# EAGLE design v1.2 (EAGLE 9.4.2)
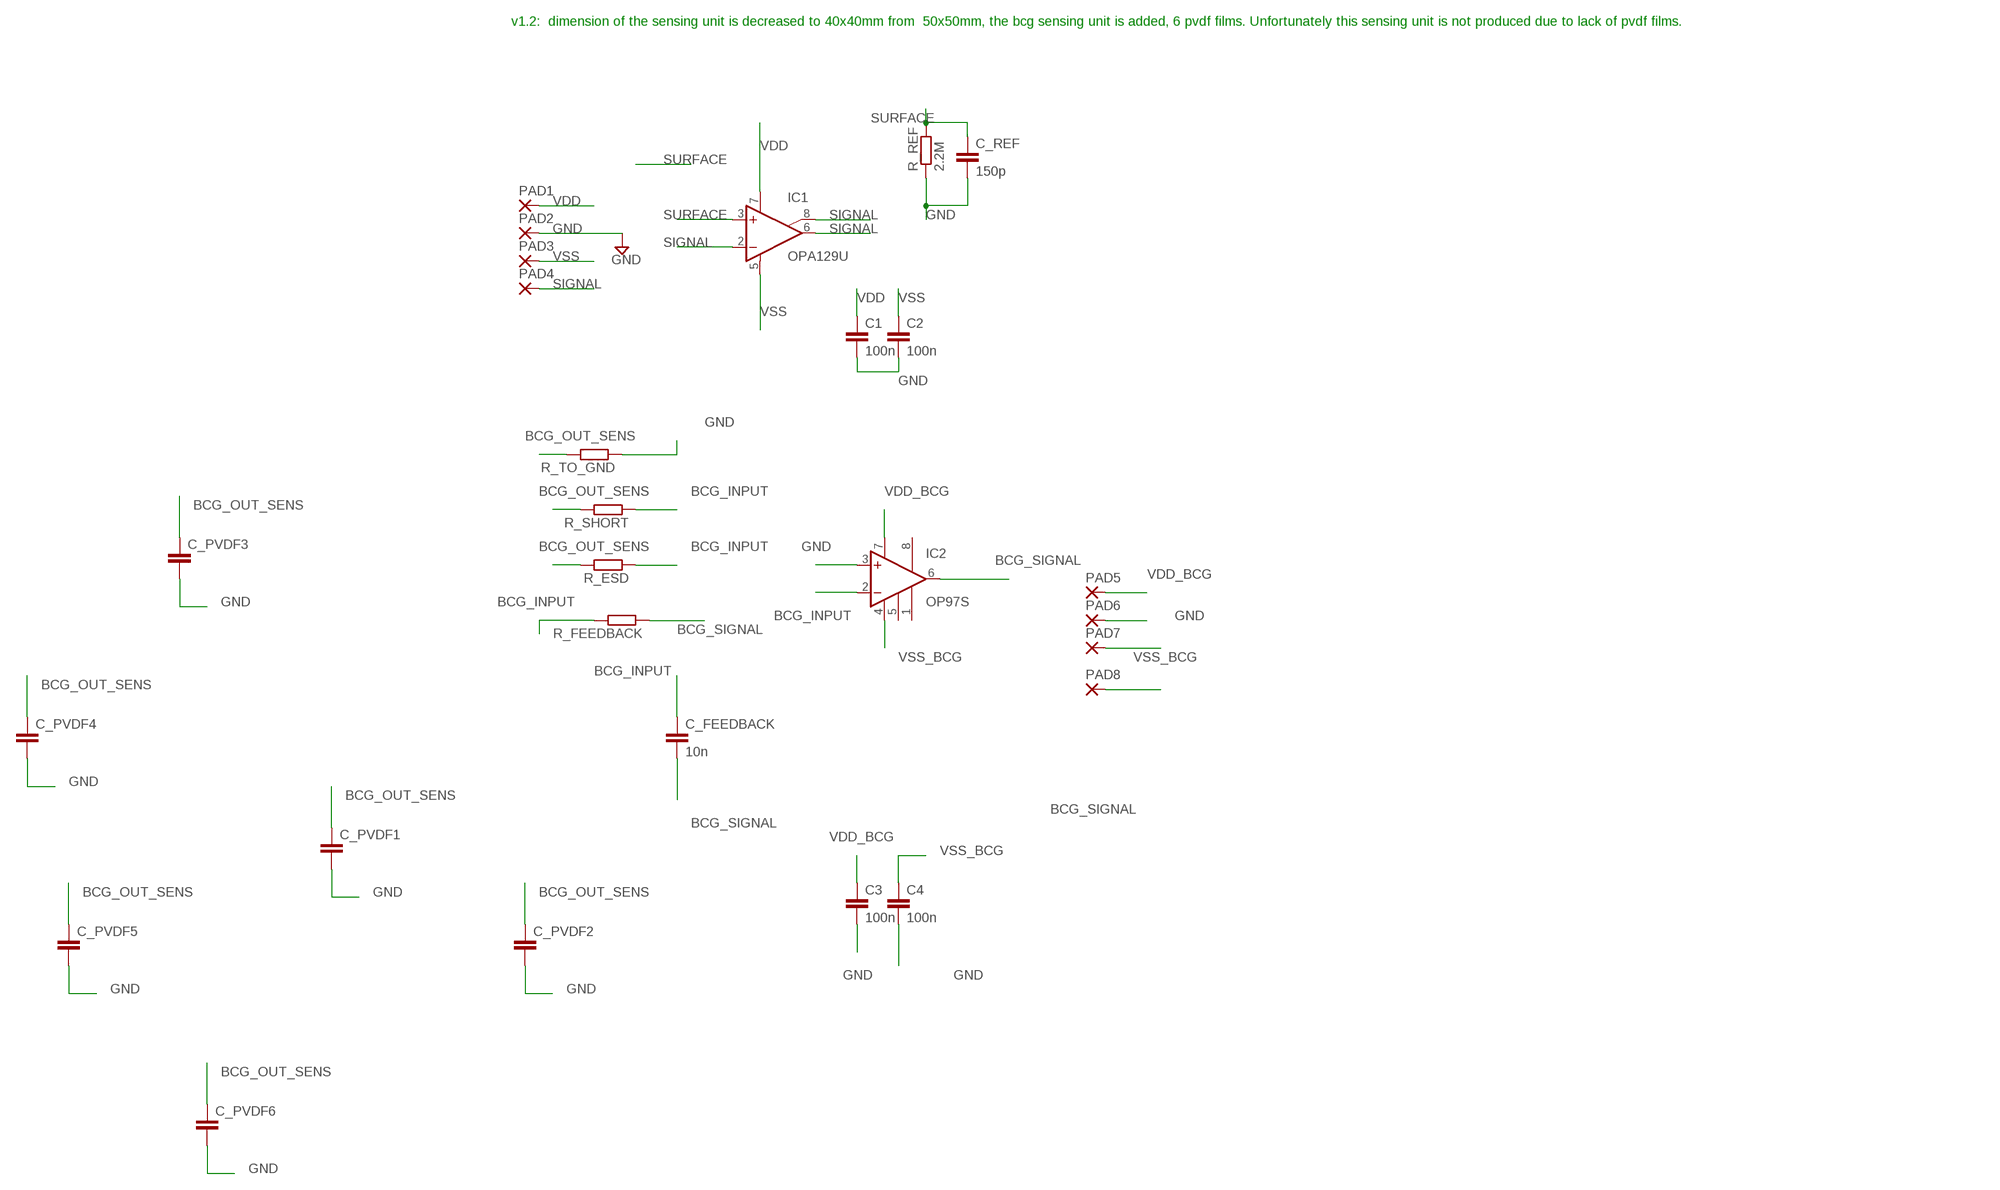
[diagram p0: schematic, sheet 1]

## Parts
C1  100n  C-EUC0805  [C0805]
C2  100n  C-EUC0805  [C0805]
C3  100n  C-EUC0805  [C0805]
C4  100n  C-EUC0805  [C0805]
C_FEEDBACK  10n  C-EUC0805  [C0805]
C_PVDF1  C-EUC0805  [C0805]
C_PVDF2  C-EUC0805  [C0805]
C_PVDF3  C-EUC0805  [C0805]
C_PVDF4  C-EUC0805  [C0805]
C_PVDF5  C-EUC0805  [C0805]
C_PVDF6  C-EUC0805  [C0805]
C_REF  150p  C-EUC0805  [C0805]
IC1  OPA129U  [SO08]
IC2  OP97S  [SO08]
PAD1  SMD5  [SMD2,54-5,08]
PAD2  SMD5  [SMD2,54-5,08]
PAD3  SMD5  [SMD2,54-5,08]
PAD4  SMD5  [SMD2,54-5,08]
PAD5  SMD5  [SMD2,54-5,08]
PAD6  SMD5  [SMD2,54-5,08]
PAD7  SMD5  [SMD2,54-5,08]
PAD8  SMD5  [SMD2,54-5,08]
R_ESD  1M  R-EU_M0805  [M0805]
R_FEEDBACK  100M  R-EU_M0805  [M0805]
R_REF  2.2M  R-EU_M0805  [M0805]
R_SHORT  1M  R-EU_M0805  [M0805]
R_TO_GND  1M  R-EU_M0805  [M0805]

## Nets
BCG_INPUT: C_FEEDBACK.1 IC2.2(-IN) R_ESD.1 R_FEEDBACK.2 R_SHORT.1
BCG_OUT_SENS: C_PVDF1.1 C_PVDF2.1 C_PVDF3.1 C_PVDF4.1 C_PVDF5.1 C_PVDF6.1 R_ESD.2 R_SHORT.2 R_TO_GND.2
BCG_SIGNAL: C_FEEDBACK.2 IC2.6(OUT) PAD8.1(P) R_FEEDBACK.1
GND: C1.2 C2.2 C3.2 C4.2 C_PVDF1.2 C_PVDF2.2 C_PVDF3.2 C_PVDF4.2 C_PVDF5.2 C_PVDF6.2 C_REF.2 IC2.3(+IN) PAD2.1(P) PAD6.1(P) R_REF.1 R_TO_GND.1
SIGNAL: IC1.2(-IN) IC1.6(OUT) IC1.8(SUBS) PAD4.1(P)
SURFACE: C_REF.1 IC1.3(+IN) R_REF.2
VDD: C1.1 IC1.7(V+) PAD1.1(P)
VDD_BCG: C3.1 IC2.7(V+) PAD5.1(P)
VSS: C2.1 IC1.5(V-) PAD3.1(P)
VSS_BCG: C4.1 IC2.4(V-) PAD7.1(P)
Unconnected: IC2.1(BAL1) IC2.5(COMP) IC2.8(BAL2)

## Notes on the sheet
- v1.2:  dimension of the sensing unit is decreased to 40x40mm from  50x50mm, the bcg sensing unit is added, 6 pvdf films. Unfortunately this sensing unit is not produced due to lack of pvdf films.

## Library data of the parts
C1-C4 C_REF = resistor:C-EU: CAPACITOR, European symbol
C_FEEDBACK C_PVDF1-C_PVDF6 = rcl:C-EU: CAPACITOR, European symbol; SPICEPREFIX: C
IC1 = burr-brown:OPA129: Difet Operational Amplifier Ultra-Low Bias Current; MF: TEXAS INSTRUMENTS; MPN: OPA129U; OC_FARNELL: 1206925; OC_NEWARK: 80K6004
IC2 = linear:OP97: Low Power, High Precision Operational Amplifier Source: http://www.analog.com/static/imported-files/data_sheets/OP97.pdf
PAD1-PAD8 = wirepad:SMD5: SMD PAD
R_ESD R_FEEDBACK R_REF R_SHORT R_TO_GND = rcl:R-EU_: RESISTOR, European symbol; SPICEPREFIX: R

## Board
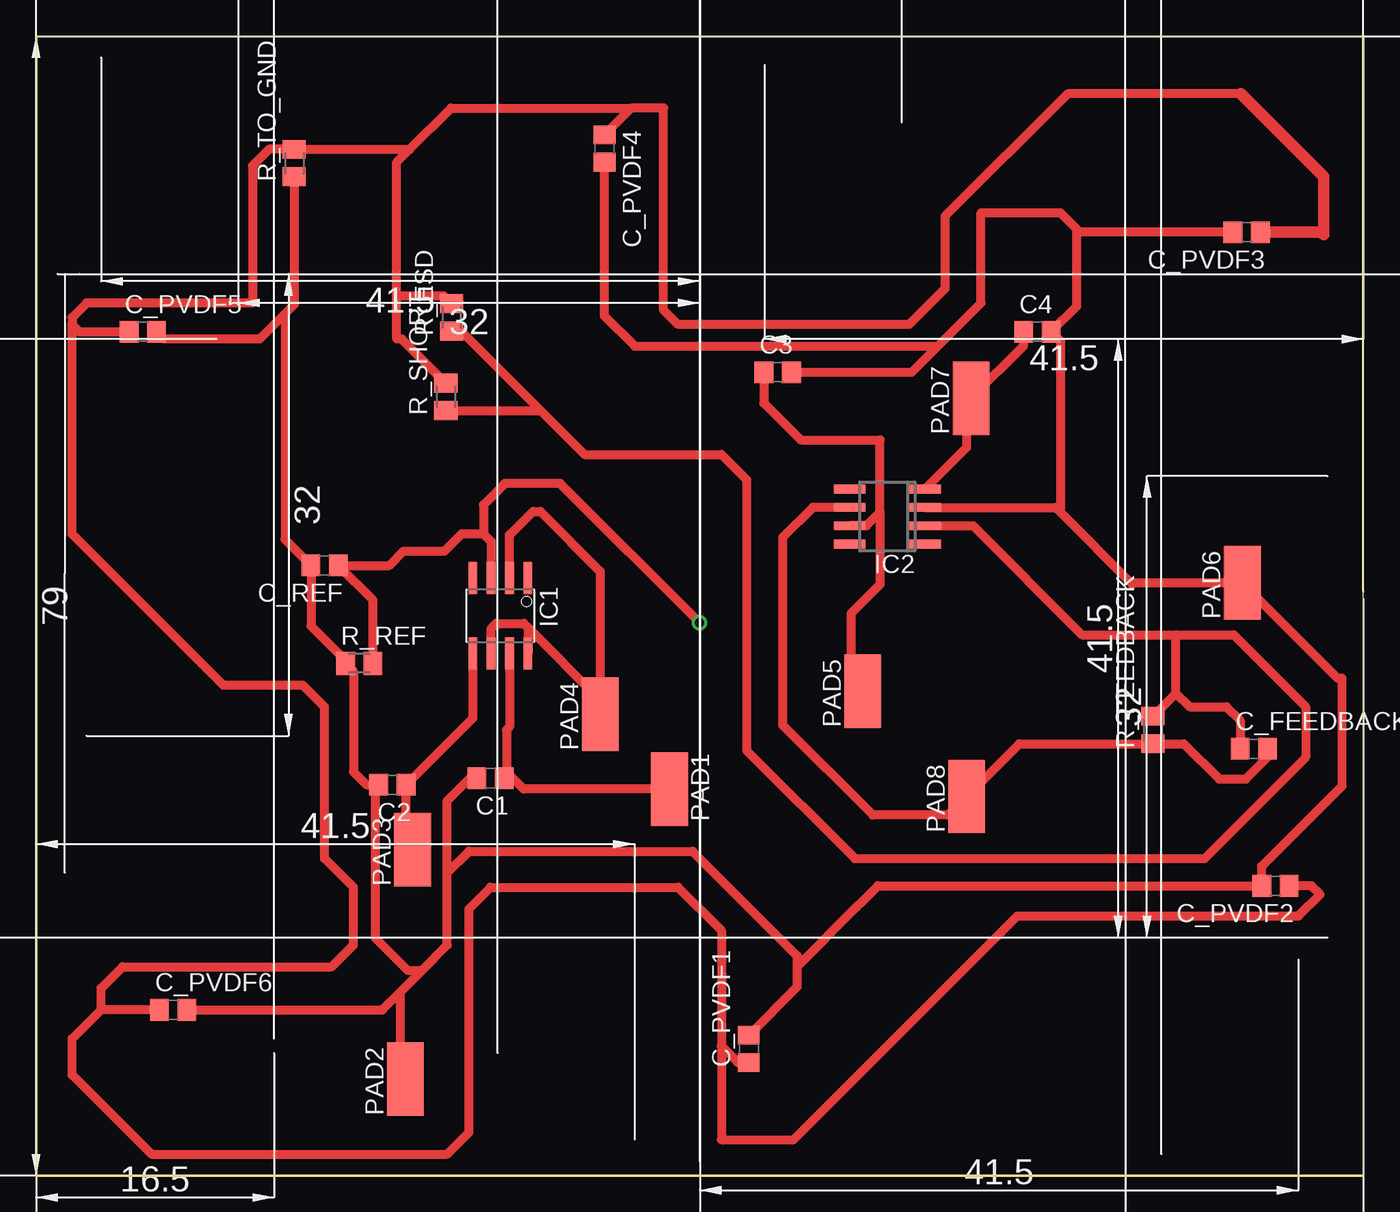
[diagram p1: board, top side]
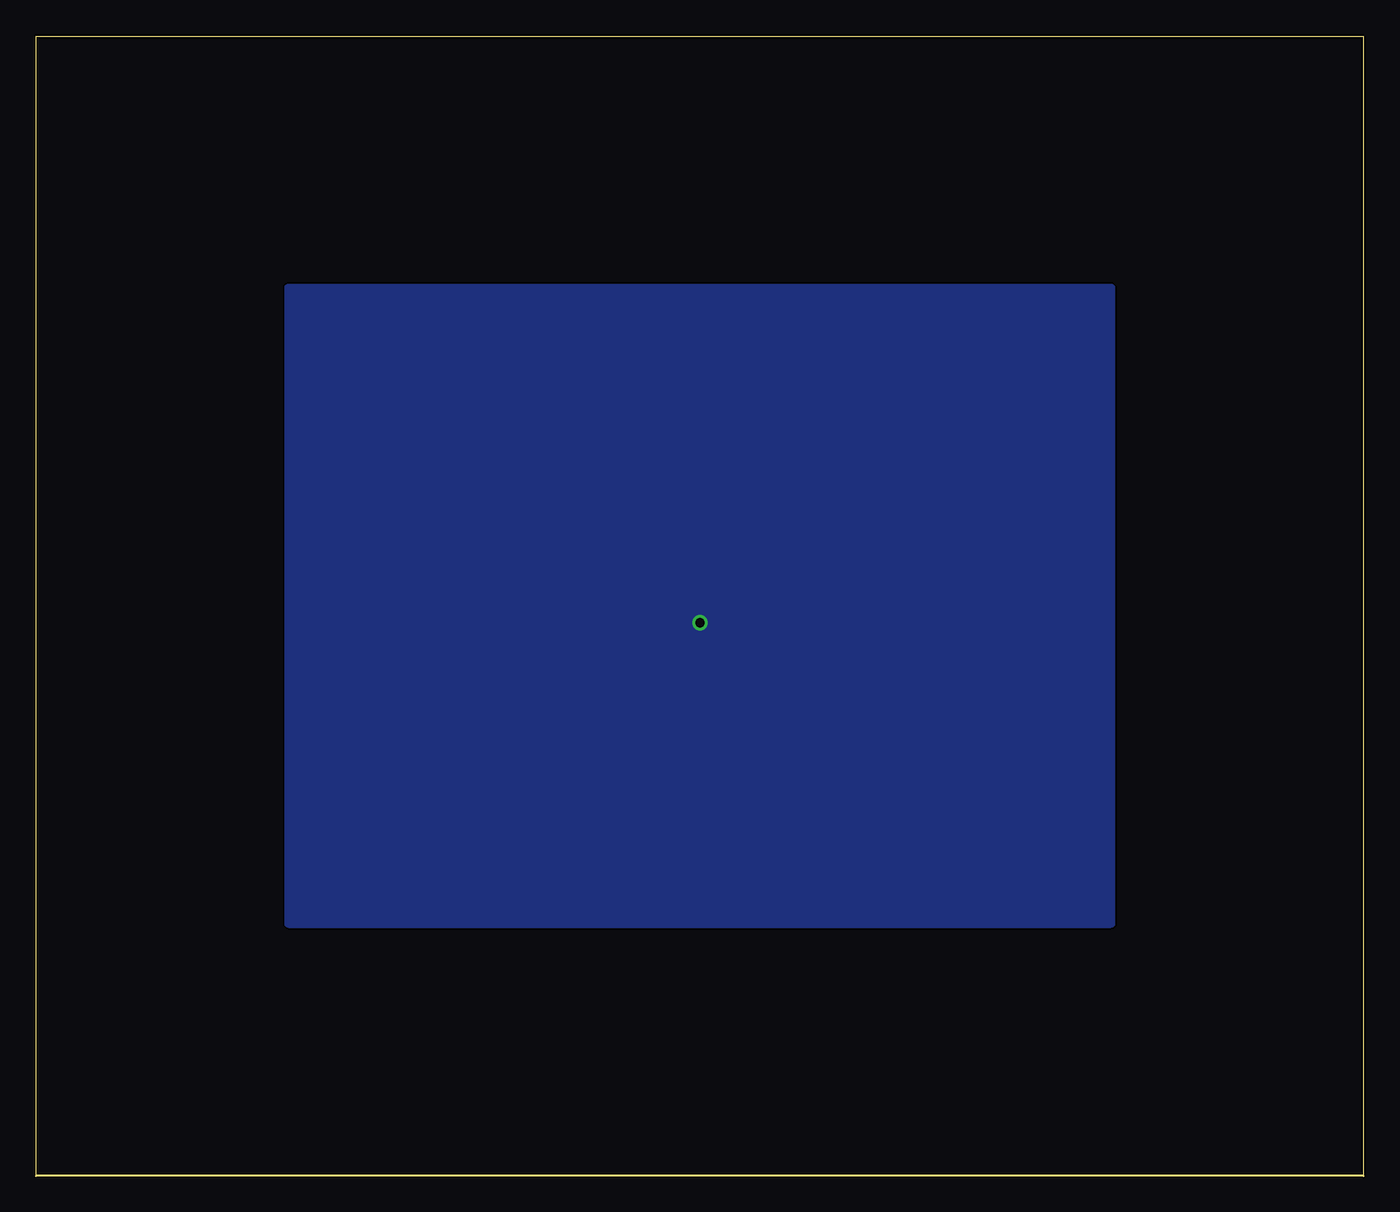
[diagram p2: board, bottom side, seen from below]

Size 92 x 79 mm. Coordinates in mm from the lower left corner, seen from the top.
Outline: 92,0 92,79 0,79 0,0 92,0
Copper layers (1*16): Top 0.035mm / dielectric 1.5mm / Bottom 0.035mm
Design rules "TM_medit_aetzen": minimum track width 10mil, minimum drill 8mil, track to track 10mil, track to pad 10mil, pad to pad 10mil, via to via 15mil, smd to smd 8mil, copper to edge 40mil, drill to drill 8mil, minimum pad ring 10mil, minimum via ring 8mil, stop-mask expansion 4mil, vias tented up to drill 0mil, thermal gap 10mil

### Footprints (pad centres in the part's own frame; a part is rotated, then mirrored left to right if it is on the bottom)
C0805 = smd 1.3 x 1.5: 1 -0.95,0; 2 0.95,0
SO08 = smd 0.61 x 2.21: 1 -1.905,-2.616; 2 -0.635,-2.616; 3 0.635,-2.616; 4 1.905,-2.616; 5 1.905,2.616; 6 0.635,2.616; 7 -0.635,2.616; 8 -1.905,2.616
SO08' = smd 0.6 x 2.2: 1 -1.905,-2.6; 2 -0.635,-2.6; 3 0.635,-2.6; 4 1.905,-2.6; 5 1.905,2.6; 6 0.635,2.6; 7 -0.635,2.6; 8 -1.905,2.6
SMD2,54-5,08 = smd 2.54 x 5.08: 1 0,0
M0805 = smd 1.3 x 1.6: 1 -0.95,0; 2 0.95,0

### Placement (x,y rotation side)
C1  31.5,27.56 180 top
C2  24.7,27.1 180 top
C3  51.4,55.7 0 top
C4  69.4,58.5 0 top
C_FEEDBACK  84.4,29.6 0 top
C_PVDF1  49.4,8.8 90 top
C_PVDF2  85.9,20.1 180 top
C_PVDF3  83.9,65.4 180 top
C_PVDF4  39.4,71.2 270 top
C_PVDF5  7.4,58.5 0 top
C_PVDF6  9.5,11.5 0 top
C_REF  20,42.31 180 top
IC1  32.18,38.82 180 top
IC2  OP97S  [SO08']  59,45.7 90 top
PAD1  43.9,26.8 180 top
PAD2  25.6,6.7 0 top
PAD3  26.1,22.6 0 top
PAD4  39.1,32 0 top
PAD5  57.3,33.6 0 top
PAD6  83.6,41.1 0 top
PAD7  64.8,53.9 0 top
PAD8  64.5,26.3 0 top
R_ESD  28.8,59.5 90 top
R_FEEDBACK  77.4,30.9 90 top
R_REF  22.4,35.52 0 top
R_SHORT  28.4,54 90 top
R_TO_GND  17.9,70.2 90 top

### Tracks (layer width: path | path; a pad name or v marks a point on that pad's centre or on a via)
BCG_INPUT
  Top 0.61: R_SHORT.1 34.95,53.05 | 34.95,53.05 29.45,58.55 R_ESD.1 | 34.95,53.05 38,50 47.5,50 49.25,48.25 49.25,29.5 56.75,22 81,22 88,29 88,32.5 83,37.5 79,37.5 | 79,33.45 79,37.5 | 79,33.45 R_FEEDBACK.2 | 79,33.45 79.95,32.5 82.5,32.5 83.45,31.55 C_FEEDBACK.1 | IC2.2 64.94,45.06 72.5,37.5 79,37.5
BCG_OUT_SENS
  Top 0.61: R_SHORT.2 25.35,58 25,58 25,61 | 25,61 28.25,61 R_ESD.2 | 25,61 25,70.25 25.9,71.15 | 47.5,9 47.5,17 44.5,20 31.5,20 30,18.5 30,3 28.5,1.5 8,1.5 2.5,7 2.5,9.5 4.5,11.5 | 47.5,9 47.5,2.5 52.5,2.5 68,18 87.5,18 89,19.5 88.4,20.1 C_PVDF2.1 | 47.5,9 48.65,7.85 C_PVDF1.1 | 83.5,75 71.5,75 63,66.5 63,61.5 60.5,59 44.5,59 43.5,60 43.5,74 41.25,74 | 41.25,74 C_PVDF4.1 | 25.9,71.15 28.75,74 41.25,74 | 25.9,71.15 R_TO_GND.2 16.15,71.15 15,70 15,60.5 3.5,60.5 2.5,59.5 2.5,59 | 2.5,59 3,58.5 C_PVDF5.1 | C_PVDF6.1 4.5,11.5 | 4.5,11.5 4.5,13 6,14.5 20.5,14.5 22,16 22,20 20,22 20,32.5 18.5,34 13,34 2.5,44.5 2.5,59
  Top 0.813: C_PVDF3.1 89.1,65.4 89.25,65.25 89.25,69.25 83.5,75
BCG_SIGNAL
  Top 0.61: IC2.6 53.84,46.34 51.75,44.25 51.75,31.25 58,25 63.2,25 PAD8.1 68.15,29.95 R_FEEDBACK.1 79.55,29.95 82,27.5 83.85,27.5 85.35,29 C_FEEDBACK.2
GND
  Top 0.61: 72.12,65.62 71,66.75 65.5,66.75 65.5,60.5 62.5,57.5 | 26.75,14.25 28.5,16 28.5,21 | 28.5,21 28.5,26 30.06,27.56 C1.2 | 28.5,21 30,22.5 45.5,22.5 52.75,15.25 52.75,14.5 | 52.75,14.5 52.75,13.1 C_PVDF1.2 | 52.75,14.5 56.88,18.62 57.25,19 58.35,20.1 C_PVDF2.2 84.95,21.45 90.5,27 90.5,34.5 90.2,34.5 PAD6.1 76.1,41.1 76,41 71,46 | IC2.3 70.67,46.34 71,46 | 72.12,65.62 72.12,60.27 C4.2 71,57.85 71,46 | C3.2 60.7,55.7 62.5,57.5 | C_PVDF4.2 39.4,59.6 41.5,57.5 62.5,57.5 | R_TO_GND.1 17.9,60.4 17.25,59.75 | 17.25,59.75 15.5,58 8.85,58 C_PVDF5.2 | 17.25,59.75 17.25,44.11 C_REF.2 19.05,38.12 21.55,35.62 R_REF.1 22,34.97 22,28 22.9,27.1 C2.2 23.5,26.85 23.5,16.5 25.75,14.25 26.75,14.25 | C_PVDF6.2 24,11.5 25.25,12.75 | 25.25,12.75 26.75,14.25 | PAD2.1 25.25,7.05 25.25,12.75 | C_PVDF3.2 72.35,65.4 72.12,65.62
SIGNAL
  Top 0.61: IC1.6 31.55,37.95 31.9,38.3 33.8,38.3 34.09,38.02 | 34.09,38.02 IC1.8 | IC1.2 32.81,44.41 34.45,46.05 34.95,46.05 39.1,41.9 39.1,33 | 34.09,38.02 39.1,33 | 39.1,33 PAD4.1
SURFACE  (via drill 0.65)
  Top 0.61: C_REF.1 24.49,42.31 25.48,43.3 28.3,43.3 29.5,44.5 31,44.5 | 20.85,42.21 C_REF.1 | IC1.3 31.55,43.95 31,44.5 | v45.98,38.34 36.32,48 32.5,48 31,46.5 31,44.5 | R_REF.2 23.35,39.91 C_REF.1
  pour Bottom: 74.5,61.5 74.5,17.5 17.5,17.5 17.5,61.5
VDD
  Top 0.61: IC1.7 32.81,31.11 32.6,30.9 32.6,28 | 32.6,28 32.6,27.71 C1.1 | PAD1.1 33.8,26.8 32.6,28
VDD_BCG
  Top 0.61: 58.5,46 57.56,45.06 IC2.7 | 58.5,46 58.5,41 56.5,39 56.5,34.4 PAD5.1 | 58.5,46 58.5,51 53,51 50.45,53.55 C3.1
VSS
  Top 0.61: IC1.5 30.27,31.73 C2.1 25.65,23.05 PAD3.1
VSS_BCG
  Top 0.61: IC2.4 64.5,50.51 64.5,53.6 PAD7.1 68.45,57.55 C4.1